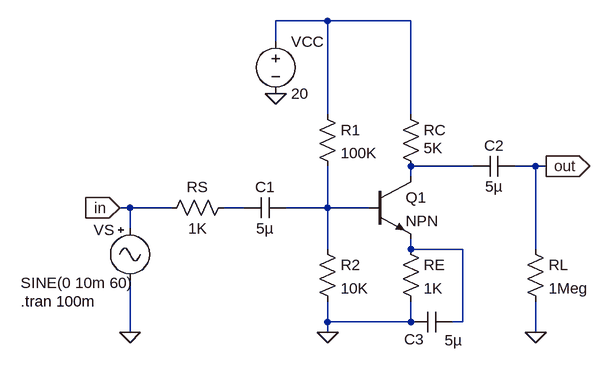
[diagram p0: schematic bjt_ce_cap_amp.asc]
bjt_ce_cap_amp.asc, the LTspice schematic file:
Version 4.1
SHEET 1 880 680
WIRE 400 -224 320 -224
WIRE 528 -224 400 -224
WIRE 320 -192 320 -224
WIRE 400 -80 400 -224
WIRE 528 -80 528 -224
WIRE 624 0 528 0
WIRE 720 0 688 0
WIRE 736 0 720 0
WIRE 528 16 528 0
WIRE 96 64 80 64
WIRE 160 64 96 64
WIRE 272 64 240 64
WIRE 400 64 400 0
WIRE 400 64 336 64
WIRE 464 64 400 64
WIRE 96 96 96 64
WIRE 400 128 400 64
WIRE 528 128 528 112
WIRE 608 128 528 128
WIRE 720 128 720 0
WIRE 400 240 400 208
WIRE 528 240 528 208
WIRE 528 240 400 240
WIRE 608 240 608 128
WIRE 608 240 592 240
WIRE 96 256 96 176
WIRE 400 256 400 240
WIRE 720 256 720 208
FLAG 320 -112 0
FLAG 400 256 0
FLAG 720 256 0
FLAG 96 256 0
FLAG 736 0 out
IOPIN 736 0 Out
FLAG 80 64 in
IOPIN 80 64 In
SYMBOL Misc\\signal 96 80 R0
WINDOW 0 -56 18 Left 2
WINDOW 3 -168 100 Left 2
SYMATTR InstName VS
SYMATTR Value SINE(0 10m 60)
SYMBOL res 256 48 R90
WINDOW 0 0 56 VBottom 2
WINDOW 3 32 56 VTop 2
SYMATTR InstName RS
SYMATTR Value 1K
SYMBOL cap 336 48 R90
WINDOW 0 0 32 VBottom 2
WINDOW 3 32 32 VTop 2
SYMATTR InstName C1
SYMATTR Value 5µ
SYMBOL voltage 320 -208 R0
SYMATTR InstName VCC
SYMATTR Value 20
SYMBOL npn 464 16 R0
SYMATTR InstName Q1
SYMBOL res 512 112 R0
SYMATTR InstName RE
SYMATTR Value 1K
SYMBOL res 384 112 R0
SYMATTR InstName R2
SYMATTR Value 10K
SYMBOL res 384 -96 R0
SYMATTR InstName R1
SYMATTR Value 100K
SYMBOL res 512 -96 R0
WINDOW 3 36 68 Left 2
SYMATTR Value 5K
SYMATTR InstName RC
SYMBOL cap 688 -16 R90
WINDOW 0 0 32 VBottom 2
WINDOW 3 32 32 VTop 2
SYMATTR InstName C2
SYMATTR Value 5µ
SYMBOL res 704 112 R0
SYMATTR InstName RL
SYMATTR Value 1Meg
SYMBOL cap 592 224 R90
WINDOW 0 58 59 VBottom 2
WINDOW 3 29 -2 VTop 2
SYMATTR InstName C3
SYMATTR Value 5µ
TEXT -72 208 Left 2 !.tran 100m

The netlist it stands for:
* bjt_ce_cap_amp.asc
VS in 0 SINE(0 10m 60)
RS N003 in 1K
C1 N004 N003 5µ
VCC N001 0 20
Q1 N002 N004 N005 0 NPN
RE N005 0 1K
R2 N004 0 10K
R1 N001 N004 100K
RC N001 N002 5K
C2 out N002 5µ
RL out 0 1Meg
C3 N005 0 5µ
.model NPN NPN
.model PNP PNP
.lib standard.bjt
.tran 100m
.backanno
.end